# EAGLE schematic esp8266-event-notifier (EAGLE 9.6.0)
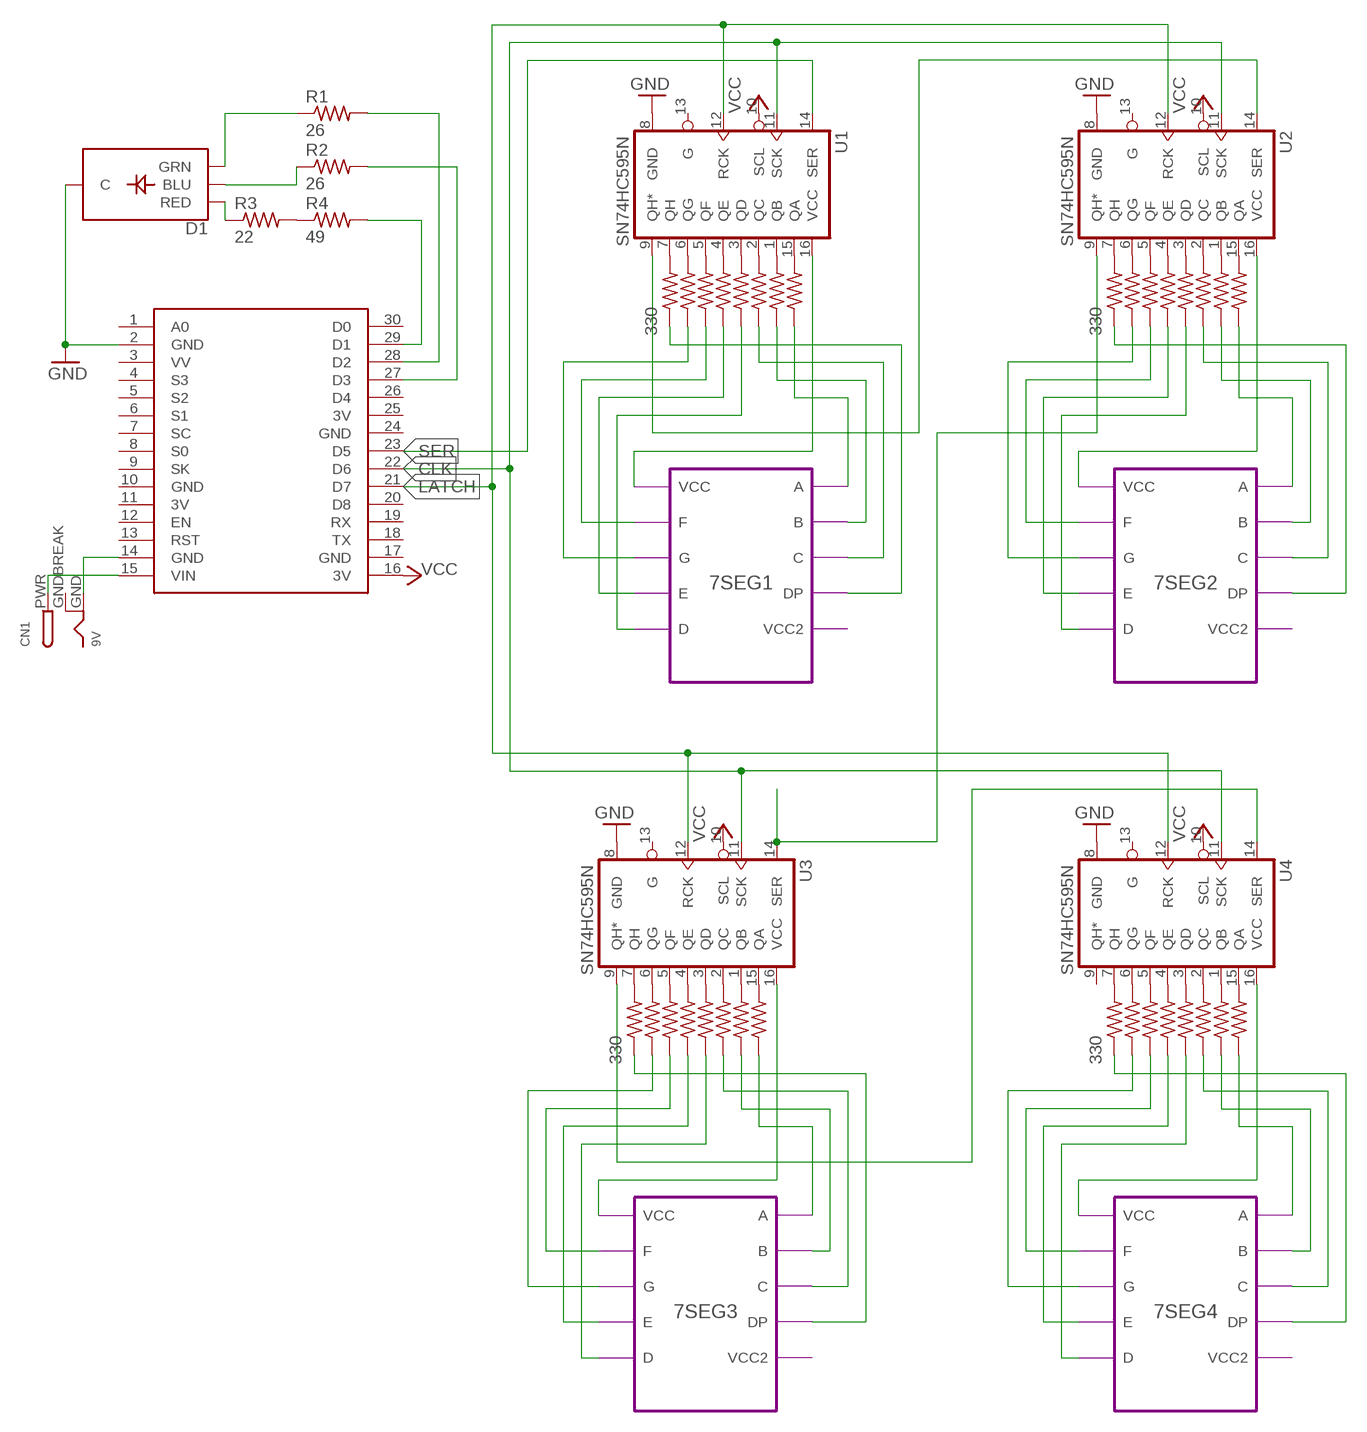
[diagram p0: schematic, sheet 1]

## Parts
CN1  9V  DCBARRELPTH  [DCJACK_2MM_PTH]
D1  XZM2CRKM2DGFBB45SCCB  SUNLEDSMD1  [PLCC4SMDLED]
R1  26  R-US_R0805  [R0805]
R2  26  R-US_R0805  [R0805]
R3  22  R-US_R0805  [R0805]
R4  49  R-US_R0805  [R0805]
R5  330  R-US_R0805  [R0805]
R6  330  R-US_R0805  [R0805]
R7  330  R-US_R0805  [R0805]
R8  330  R-US_R0805  [R0805]
R9  330  R-US_R0805  [R0805]
R10  330  R-US_R0805  [R0805]
R11  330  R-US_R0805  [R0805]
R12  330  R-US_R0805  [R0805]
R13  330  R-US_R0805  [R0805]
R14  330  R-US_R0805  [R0805]
R15  330  R-US_R0805  [R0805]
R16  330  R-US_R0805  [R0805]
R17  330  R-US_R0805  [R0805]
R18  330  R-US_R0805  [R0805]
R19  330  R-US_R0805  [R0805]
R20  330  R-US_R0805  [R0805]
R21  330  R-US_R0805  [R0805]
R22  330  R-US_R0805  [R0805]
R23  330  R-US_R0805  [R0805]
R24  330  R-US_R0805  [R0805]
R25  330  R-US_R0805  [R0805]
R26  330  R-US_R0805  [R0805]
R27  330  R-US_R0805  [R0805]
R28  330  R-US_R0805  [R0805]
R29  330  R-US_R0805  [R0805]
R30  330  R-US_R0805  [R0805]
R31  330  R-US_R0805  [R0805]
R32  330  R-US_R0805  [R0805]
R33  330  R-US_R0805  [R0805]
R34  330  R-US_R0805  [R0805]
R35  330  R-US_R0805  [R0805]
R36  330  R-US_R0805  [R0805]
U1  SN74HC595N  74HC595N  [DIP16]
U2  SN74HC595N  74HC595N  [DIP16]
U3  SN74HC595N  74HC595N  [DIP16]
U4  SN74HC595N  74HC595N  [DIP16]
U$1  NODEMCU  [NODEMCU]

## Module instances
7SEG1 = LSHD-A101
7SEG2 = LSHD-A101
7SEG3 = LSHD-A101
7SEG4 = LSHD-A101

## Nets
CLK: U1.11(SCK) U2.11(SCK) U3.11(SCK) U4.11(SCK) U$1.22(D6)
GND: D1.4(C) U1.8(GND) U2.8(GND) U3.8(GND) U4.8(GND) U$1.2(GND)
LATCH: U1.12(RCK) U2.12(RCK) U3.12(RCK) U4.12(RCK) U$1.21(D7)
N$1: R5.1 ; port 7SEG1.DP
N$2: R6.1 ; port 7SEG1.G
N$3: R7.1 ; port 7SEG1.F
N$4: U1.16(VCC) ; port 7SEG1.VCC
N$5: R8.1 ; port 7SEG1.E
N$6: R9.1 ; port 7SEG1.D
N$7: R10.1 ; port 7SEG1.C
N$8: R11.1 ; port 7SEG1.B
N$9: R12.1
N$10: R5.2 U1.7(QH)
N$11: R6.2 U1.6(QG)
N$12: R7.2 U1.5(QF)
N$13: R8.2 U1.4(QE)
N$14: R9.2 U1.3(QD)
N$15: R10.2 U1.2(QC)
N$16: R11.2 U1.1(QB)
N$17: R12.2 U1.15(QA)
N$18: R13.1 ; port 7SEG2.DP
N$19: R14.1 ; port 7SEG2.G
N$20: R15.1 ; port 7SEG2.F
N$21: U2.16(VCC) ; port 7SEG2.VCC
N$22: R16.1 ; port 7SEG2.E
N$23: R17.1 ; port 7SEG2.D
N$24: R18.1 ; port 7SEG2.C
N$25: R19.1 ; port 7SEG2.B
N$26: R20.1
N$27: U1.9(QH*) U2.14(SER)
N$28: port 7SEG1.VCC2
N$29: CN1.PWR U$1.15(VIN)
N$30: R13.2 U2.7(QH)
N$31: R14.2 U2.6(QG)
N$32: R15.2 U2.5(QF)
N$33: R16.2 U2.4(QE)
N$34: R17.2 U2.3(QD)
N$35: R18.2 U2.2(QC)
N$36: R19.2 U2.1(QB)
N$37: R20.2 U2.15(QA)
N$38: CN1.GND U$1.14(GND)
N$41: port 7SEG2.VCC2
N$43: D1.3(BLU) R2.1
N$44: D1.2(GRN) R1.1
N$45: D1.1(RED) R3.1
N$46: R3.2 R4.1
N$47: R4.2 U$1.29(D1)
N$48: R1.2 U$1.28(D2)
N$49: R2.2 U$1.27(D3)
N$50: U2.9(QH*) U3.14(SER)
N$51: R21.1 ; port 7SEG3.DP
N$52: R22.1 ; port 7SEG3.G
N$53: R23.1 ; port 7SEG3.F
N$54: U3.16(VCC) ; port 7SEG3.VCC
N$55: R24.1 ; port 7SEG3.E
N$56: R25.1 ; port 7SEG3.D
N$57: R26.1 ; port 7SEG3.C
N$58: R27.1 ; port 7SEG3.B
N$59: R28.1
N$61: R21.2 U3.7(QH)
N$62: R22.2 U3.6(QG)
N$63: R23.2 U3.5(QF)
N$64: R24.2 U3.4(QE)
N$65: R25.2 U3.3(QD)
N$66: R26.2 U3.2(QC)
N$67: R27.2 U3.1(QB)
N$68: R28.2 U3.15(QA)
N$71: port 7SEG3.VCC2
N$72: U3.9(QH*) U4.14(SER)
N$73: R29.1 ; port 7SEG4.DP
N$74: R30.1 ; port 7SEG4.G
N$75: R31.1 ; port 7SEG4.F
N$76: U4.16(VCC) ; port 7SEG4.VCC
N$77: R32.1 ; port 7SEG4.E
N$79: R33.1 ; port 7SEG4.D
N$80: R34.1 ; port 7SEG4.C
N$81: R35.1 ; port 7SEG4.B
N$82: R36.1
N$84: R29.2 U4.7(QH)
N$85: R30.2 U4.6(QG)
N$86: R31.2 U4.5(QF)
N$87: R32.2 U4.4(QE)
N$88: R33.2 U4.3(QD)
N$89: R34.2 U4.2(QC)
N$90: R35.2 U4.1(QB)
N$91: R36.2 U4.15(QA)
N$94: port 7SEG4.VCC2
SER: U1.14(SER) U$1.23(D5)
VCC: U1.10(SCL) U2.10(SCL) U3.10(SCL) U4.10(SCL) U$1.16(3V)
Unconnected: U1.13(G) U2.13(G) U3.13(G) U4.9(QH*) U4.13(G) U$1.1(A0) U$1.3(VV) U$1.4(S3) U$1.5(S2) U$1.6(S1) U$1.7(SC) U$1.8(S0) U$1.9(SK) U$1.12(EN) U$1.13(RST) U$1.18(TX) U$1.19(RX) U$1.20(D8) U$1.26(D4) U$1.30(D0)

## Power pins joined to a net without a drawn wire
3V: U$1.11(3V) U$1.25(3V)
GND: U$1.10(GND) U$1.17(GND) U$1.24(GND)
GNDBREAK: CN1.GNDBREAK

## Library data of the parts
CN1 = adafruit:DCBARREL: 2.0mm DC Barrel Jack DCJACK_2MM_PTH - Through Hole Jack (4UConnector: 05537)
D1 = SparkFun-LED:SUNLED: LED-RGB Common Cathode XZM2CRKM2DGFBB45SCCB Packages: PLCC4 SparkFun Products: Lilypad Prototyping Board <[https://www.sparkfun.com/products/9264]>; PROD_ID: DIO-13722
R1-R36 = adafruit:R-US_: RESISTOR, American symbol
U1-U4 = SparkFun-IC-Logic:74*595: 8-Bit Shift Register (Serial to Parallel) Datasheet <http://cdn.sparkfun.com/datasheets/BreakoutBoards/MM74HC595.pdf> SparkFun Products SparkFun Shift Register Breakout - 74HC595 <https://www.sparkfun.com/products/10680> (BOB-10680); PROD_ID: IC-13123
U$1 = nodemcu:NODEMCU

## Module LSHD-A101
Ports: VCC(io) F(io) G(io) E(io) D(io) VCC2(io) DP(io) C(io) B(io) A(io)

### Library data of the parts